# Altium schematic sheet PerfBoard.SchDoc
size A; SheetNumber: 5; SheetTotal: 5
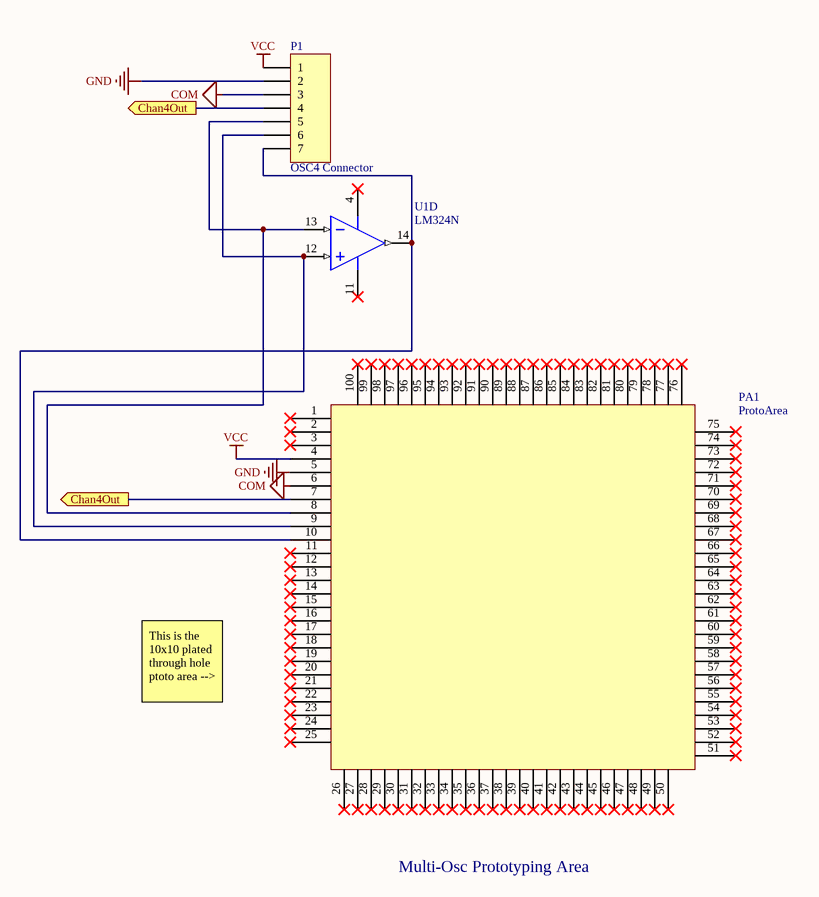
[diagram p0: PerfBoard.SchDoc]

## Parts
P1  OSC4 Connector  [HDR1X7]
PA1  ProtoArea  [ProtoArea]  (no BOM)
U1  LM324N  [N0014A]  (part D of 4)

## Ports
Chan4Out (out)

## Nets
COM: P1.3 PA1.6
GND: P1.2 PA1.5
VCC: P1.1 PA1.4
Chan4Out: P1.4 PA1.7 ; port Chan4Out
NetP1_5: P1.5 PA1.8 U1.13(IN4-)
NetP1_6: P1.6 PA1.9 U1.12(IN4+)
NetP1_7: P1.7 PA1.10 U1.14(OUT4)

Not connected (* = marked no-connect by the designer): PA1 1* 2* 3* 11* 12* 13* 14* 15* 16* 17* 18* 19* 20* 21* 22* 23* 24* 25* 26* 27* 28* 29* 30* 31* 32* 33* 34* 35* 36* 37* 38* 39* 40* 41* 42* 43* 44* 45* 46* 47* 48* 49* 50* 51* 52* 53* 54* 55* 56* 57* 58* 59* 60* 61* 62* 63* 64* 65* 66* 67* 68* 69* 70* 71* 72* 73* 74* 75* 76* 77* 78* 79* 80* 81* 82* 83* 84* 85* 86* 87* 88* 89* 90* 91* 92* 93* 94* 95* 96* 97* 98* 99* 100*; U1 4(V+)* 11(GND)*

## Notes on the sheet
- This is the 10x10 plated through hole ptoto area -->
- Multi-Osc Prototyping Area

## Library data of the parts
P1 = Header 7: Header, 7-Pin; LatestRevisionDate: 17-Jul-2002; LatestRevisionNote: Re-released for DXP Platform.; Publisher: Altium Limited
PA1 = PerfBoard
U1 = CMP-0055-00082-3: Low Power Quad Operational Amplifier, 14-pin MDIP; Manufacturer: Texas Instruments; CompType: Amplifiers; PowerWise: N; PackageTopMarking: NSUZXYYTTE#*LM324N; PackageDescription: MDIP, .750 x .250 x.130in, 14 Lead, .100in Pitch; Package Reference: N0014A; RoHS: N; Code_JEDEC: MS-001-AA; ComponentLink1URL: http://www.ti.com/general/docs/lit/getliterature.tsp?genericPartNumber=LM324&fileType=pdf; ComponentLink1Description: Datasheet URL; PinCount: 14